# Altium project 农业-阀控器.PrjPcb
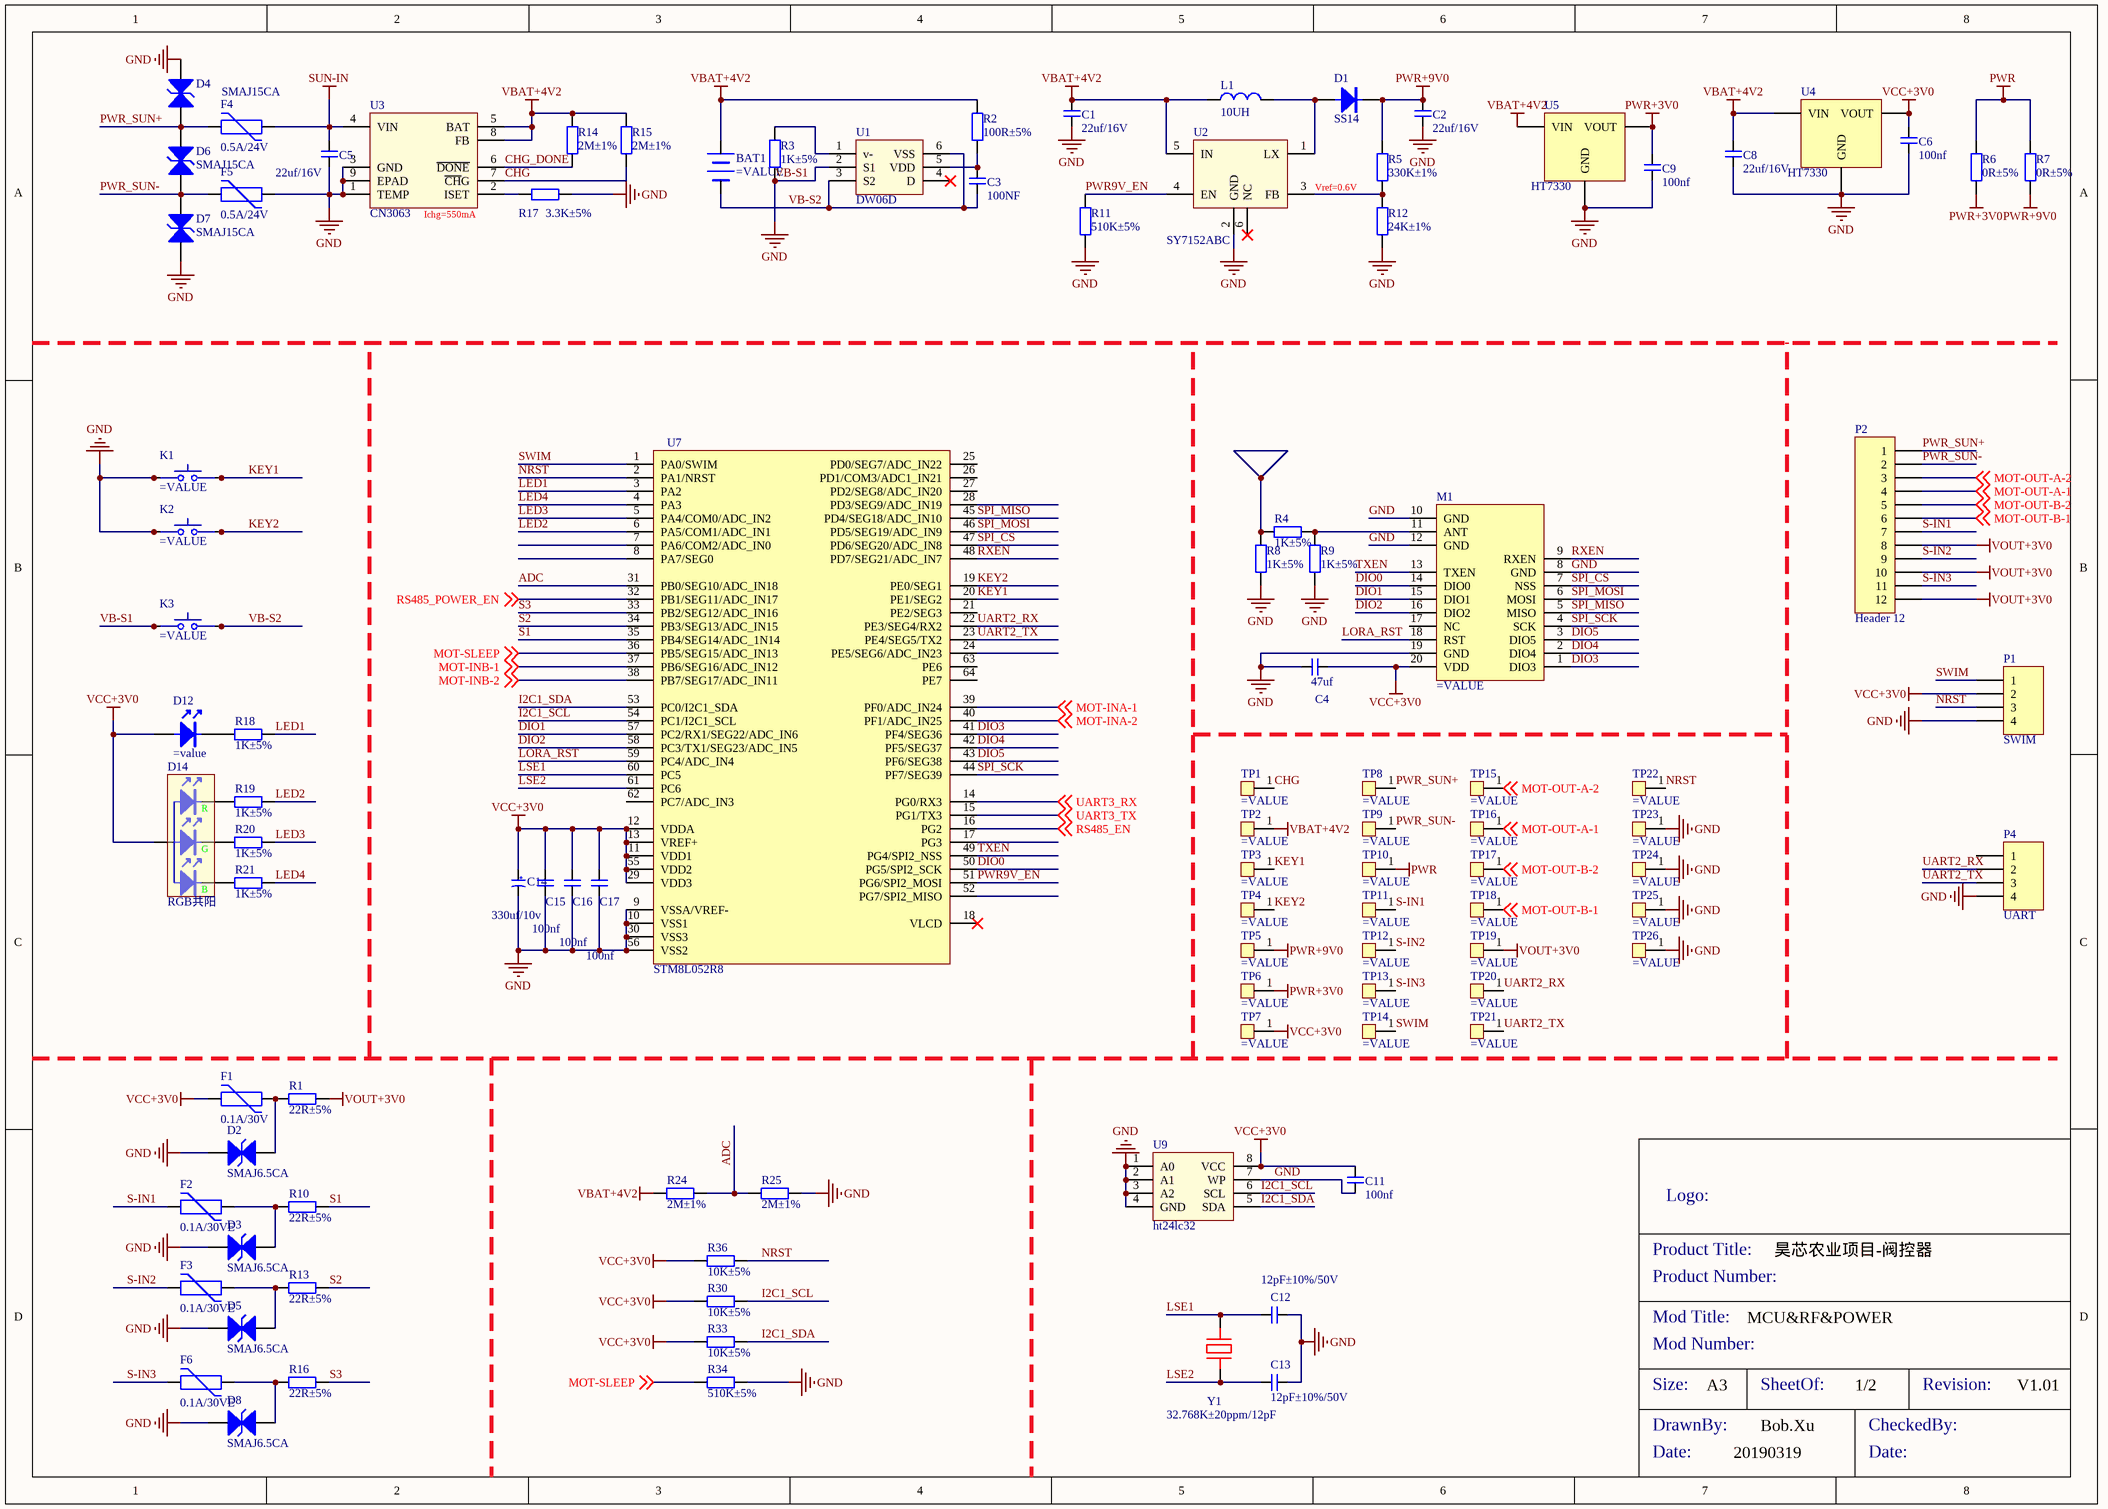
[diagram p0: RHX-NYFK-SCH21V1.01.SchDoc]
2 sheets, 131 parts. Net scope: global (net labels, ports and power ports of the same name join across sheets).
Board file: RHX-NYFK-PCB11V1.01.PcbDoc
Sheets:
  RHX-NYFK-SCH21V1.01.SchDoc
  RHX-NYFK-SCH22V1.01.SchDoc

## Sheet RHX-NYFK-SCH21V1.01.SchDoc
size A3; Date: 20190319; CompanyName: 瑞臻信息（深圳）有限公司; DrawnBy: Bob.Xu; Address1: 深圳市南山区深南路万利达大厦2201室; Address2: 昆山市花桥镇花桥国际商务城绿地大道231弄9号楼杰座大厦2111室; Address3: 成都市高新区天府二街138号蜀都中心3号楼3110室; Address4: 浙江省宁波市余姚市冶山路475号1401室; Revision: V1.01; SheetOf: 1/2; ProductTitle: 昊芯农业项目-阀控器; ModuleTitle: MCU&RF&POWER; : CheckedBy; PageSetup: Record=PageOptions|CenterHorizontal=True|CenterVertical=True|PrintScale=0.73|XCorrection=1.00|YCorrection=1.00|PrintKind=0|BorderSize=5000000|LeftOffset=0|BottomOffset=0|Orientation=2|PaperLength=1000|PaperWidth=1000|Scale=100|PaperSource=7|PrintQuality=-3|MediaType=1|DitherType=10|PrintScaleMode=1|PaperKind=A4|PaperIndex=9

### Parts
BAT1  (no value)  [HDR1X2]
C1  22uf/16V  [c1206]
C2  22uf/16V  [c1206]
C3  100NF  [C0402]
C4  47uf  [C1206]
C5  22uf/16V  [c1206]
C6  100nf  [c0402]
C8  22uf/16V  [c1206]
C9  100nf  [c0402]
C11  100nf  [C0402]
C12  12pF±10%/50V  [C0402]
C13  12pF±10%/50V  [C0402]
C14  330uf/10v  [CAP_2P_2R5_D6R3H11_W]
C15  100nf  [C0402]
C16  100nf  [C0402]
C17  100nf  [C0402]
D1  SS14  [SMA_2P_2R8X4R6]
D2  SMAJ6.5CA  [SMA_2P_2R8X4R6]
D3  SMAJ6.5CA  [SMA_2P_2R8X4R6]
D4  SMAJ15CA  [SMA_2P_2R8X4R6]
D5  SMAJ6.5CA  [SMA_2P_2R8X4R6]
D6  SMAJ15CA  [SMA_2P_2R8X4R6]
D7  SMAJ15CA  [SMA_2P_2R8X4R6]
D8  SMAJ6.5CA  [SMA_2P_2R8X4R6]
D12  (no value)  [LED_2P_2R54_D5X8R7]
D14  RGB共阳  [DIP_LED_4P_RGB_1R3_D5]
F1  0.1A/30V  [FUSE1210]
F2  0.1A/30VE  [FUSE1210]
F3  0.1A/30VE  [FUSE1210]
F4  0.5A/24V  [FUSE1210]
F5  0.5A/24V  [FUSE1210]
F6  0.1A/30VE  [FUSE1210]
K1  (no value)  [DIP_SW_4P_6R0X6R0_P]
K2  (no value)  [DIP_SW_4P_6R0X6R0_P]
K3  (no value)  [DIP_SW_4P_6R0X6R0_P]
L1  10UH  [SMD_INC_2P_4R0X4R0]
M1  (no value)  [LORA_PIN_1]
P1  SWIM  [HDR1X4]
P2  Header 12  [KF301_12P_5R08]
P4  UART  [HDR1X4]
R1  22R±5%  [R0402]
R2  100R±5%  [R0402]
R3  1K±5%  [R0402]
R4  1K±5%  [R0402]
R5  330K±1%  [R0402]
R6  0R±5%  [R0603]
R7  0R±5%  [R0603]
R8  1K±5%  [R0402]
R9  1K±5%  [R0402]
R10  22R±5%  [R0402]
R11  510K±5%  [R0402]
R12  24K±1%  [R0402]
R13  22R±5%  [R0402]
R14  2M±1%  [R0402]
R15  2M±1%  [R0402]
R16  22R±5%  [R0402]
R17  3.3K±5%  [R0402]
R18  1K±5%  [R0402]
R19  1K±5%  [R0402]
R20  1K±5%  [R0402]
R21  1K±5%  [R0402]
R24  2M±1%  [R0402]
R25  2M±1%  [R0402]
R30  10K±5%  [R0402]
R33  10K±5%  [R0402]
R34  510K±5%  [R0402]
R36  10K±5%  [R0402]
TP1  (no value)  [TP_D1R25]
TP2  (no value)  [TP_D1R25]
TP3  (no value)  [TP_D1R25]
TP4  (no value)  [TP_D1R25]
TP5  (no value)  [TP_D1R25]
TP6  (no value)  [TP_D1R25]
TP7  (no value)  [TP_D1R25]
TP8  (no value)  [TP_D1R25]
TP9  (no value)  [TP_D1R25]
TP10  (no value)  [TP_D1R25]
TP11  (no value)  [TP_D1R25]
TP12  (no value)  [TP_D1R25]
TP13  (no value)  [TP_D1R25]
TP14  (no value)  [TP_D1R25]
TP15  (no value)  [TP_D1R25]
TP16  (no value)  [TP_D1R25]
TP17  (no value)  [TP_D1R25]
TP18  (no value)  [TP_D1R25]
TP19  (no value)  [TP_D1R25]
TP20  (no value)  [TP_D1R25]
TP21  (no value)  [TP_D1R25]
TP22  (no value)  [TP_D1R25]
TP23  (no value)  [TP_D1R25]
TP24  (no value)  [TP_D1R25]
TP25  (no value)  [TP_D1R25]
TP26  (no value)  [TP_D1R25]
U1  DW06D  [SOT23_6P_0R95_1R6X2R9]
U2  SY7152ABC  [SOT23_6P_0R95_1R6X2R9]
U3  CN3063  [SOP_8P_1R27_3R9X4R9_P]
U4  HT7330  [SOT89_3P_1R5_2R5X4R5]
U5  HT7330  [SOT89_3P_1R5_2R5X4R5]
U7  STM8L052R8  [LQFP_64P_0R5_10R0X10R0]
U9  ht24lc32  [SOP_8P_1R27_3R9X4R9]
Y1  32.768K±20ppm/12pF  [SMD_Crystal_2P_1R5X3R2]

### Nets
GND: C1.1 C2.1 C4.1 C5.1 C6.1 C8.1 C9.1 C11.1 C12.1 C13.1 C14.2 C15.1 C16.1 C17.1 D2.1(A) D3.1(A) D4.2(K) D5.1(A) D7.1(A) D8.1(A) F5.2 K1.1 K1.3 K2.1 K2.3 K3.1 K3.3 M1.8(GND) M1.10(GND) M1.12(GND) M1.19(GND) P1.4 P4.4 R3.2 R8.2 R9.2 R11.2 R12.2 R17.2 R25.2 R34.1 TP23.1 TP24.1 TP25.1 TP26.1 U1.2(S1) U2.2(GND) U3.1(TEMP) U3.3(GND) U3.9(EPAD) U4.1(GND) U5.1(GND) U7.9(VSSA/VREF-) U7.10(VSS1) U7.30(VSS3) U7.56(VSS2) U9.1(A0) U9.2(A1) U9.3(A2) U9.4(GND) U9.7(WP)  [also labelled VB-S1]
PWR: R6.1 R7.1 TP10.1
PWR+3V0: C9.2 R6.2 TP6.1 U5.3(VOUT)
PWR+9V0: C2.2 D1.2(K) R5.1 R7.2 TP5.1
SUN-IN: C5.2 F4.2 U3.4(VIN)
VBAT+4V2: BAT1.1 C1.2 C8.2 L1.1 R2.1 R14.2 R15.2 R24.1 TP2.1 U2.5(IN) U3.5(BAT) U3.8(FB) U4.2(VIN) U5.2(VIN)
VCC+3V0: C4.2 C6.2 C11.2 C14.1 C15.2 C16.2 C17.2 D12.1(A) D14.2 F1.1 M1.20(VDD) P1.2 R30.2 R33.2 R36.2 TP7.1 U4.3(VOUT) U7.11(VDD1) U7.12(VDDA) U7.13(VREF+) U7.29(VDD3) U7.55(VDD2) U9.8(VCC)
VOUT+3V0: P2.8 P2.10 P2.12 R1.1 TP19.1
ADC: R24.2 R25.1 U7.31(PB0/SEG10/ADC_IN18)
CHG: R15.1 TP1.1 U3.7(~{CH}G)
CHG_DONE: R14.1 U3.6(~{DONE})
DIO0: M1.14(DIO0) U7.50(PG5/SPI2_SCK)
DIO1: M1.15(DIO1) U7.57(PC2/RX1/SEG22/ADC_IN6)
DIO2: M1.16(DIO2) U7.58(PC3/TX1/SEG23/ADC_IN5)
DIO3: M1.1(DIO3) U7.41(PF4/SEG36)
DIO4: M1.2(DIO4) U7.42(PF5/SEG37)
DIO5: M1.3(DIO5) U7.43(PF6/SEG38)
I2C1_SCL: R30.1 U7.54(PC1/I2C1_SCL) U9.6(SCL)
I2C1_SDA: R33.1 U7.53(PC0/I2C1_SDA) U9.5(SDA)
KEY1: K1.2 K1.4 TP3.1 U7.20(PE1/SEG2)
KEY2: K2.2 K2.4 TP4.1 U7.19(PE0/SEG1)
LED1: R18.1 U7.3(PA2)
LED2: R19.1 U7.6(PA5/COM1/ADC_IN1)
LED3: R20.1 U7.5(PA4/COM0/ADC_IN2)
LED4: R21.1 U7.4(PA3)
LORA_RST: M1.18(RST) U7.59(PC4/ADC_IN4)
LSE1: C12.2 U7.60(PC5) Y1.2
LSE2: C13.2 U7.61(PC6) Y1.1
MOT-INA-1: U7.39(PF0/ADC_IN24) ; off-sheet MOT-INA-1
MOT-INA-2: U7.40(PF1/ADC_IN25) ; off-sheet MOT-INA-2
MOT-INB-1: U7.37(PB6/SEG16/ADC_IN12) ; off-sheet MOT-INB-1
MOT-INB-2: U7.38(PB7/SEG17/ADC_IN11) ; off-sheet MOT-INB-2
MOT-OUT-A-1: P2.4 TP16.1 ; off-sheet MOT-OUT-A-1
MOT-OUT-A-2: P2.3 TP15.1 ; off-sheet MOT-OUT-A-2
MOT-OUT-B-1: P2.6 TP18.1 ; off-sheet MOT-OUT-B-1
MOT-OUT-B-2: P2.5 TP17.1 ; off-sheet MOT-OUT-B-2
MOT-SLEEP: R34.2 U7.36(PB5/SEG15/ADC_IN13) ; off-sheet MOT-SLEEP
NRST: P1.3 R36.1 TP22.1 U7.2(PA1/NRST)
PWR9V_EN: R11.1 U2.4(EN) U7.51(PG6/SPI2_MOSI)
PWR_SUN+: D4.1(A) D6.2(K) F4.1 P2.1 TP8.1
PWR_SUN-: D6.1(A) D7.2(K) F5.1 P2.2 TP9.1
RS485_EN: U7.16(PG2) ; off-sheet RS485_EN
RS485_POWER_EN: U7.32(PB1/SEG11/ADC_IN17) ; off-sheet RS485_POWER_EN
RXEN: M1.9(RXEN) U7.48(PD7/SEG21/ADC_IN7)
S1: R10.1 U7.35(PB4/SEG14/ADC_1N14)
S2: R13.1 U7.34(PB3/SEG13/ADC_IN15)
S3: R16.1 U7.33(PB2/SEG12/ADC_IN16)
S-IN1: F2.1 P2.7 TP11.1
S-IN2: F3.1 P2.9 TP12.1
S-IN3: F6.1 P2.11 TP13.1
SPI_CS: M1.7(NSS) U7.47(PD6/SEG20/ADC_IN8)
SPI_MISO: M1.5(MISO) U7.45(PD4/SEG18/ADC_IN10)
SPI_MOSI: M1.6(MOSI) U7.46(PD5/SEG19/ADC_IN9)
SPI_SCK: M1.4(SCK) U7.44(PF7/SEG39)
SWIM: P1.1 TP14.1 U7.1(PA0/SWIM)
TXEN: M1.13(TXEN) U7.49(PG4/SPI2_NSS)
UART2_RX: P4.2 TP20.1 U7.22(PE3/SEG4/RX2)
UART2_TX: P4.3 TP21.1 U7.23(PE4/SEG5/TX2)
UART3_RX: U7.14(PG0/RX3) ; off-sheet UART3_RX
UART3_TX: U7.15(PG1/TX3) ; off-sheet UART3_TX
VB-S2: BAT1.2 C3.1 K3.2 K3.4 U1.3(S2) U1.6(VSS)
NetC3_2: C3.2 R2.2 U1.5(VDD)
NetD1_1: D1.1(A) L1.2 U2.1(LX)
NetD2_2: D2.2(K) F1.2 R1.2
NetD3_2: D3.2(K) F2.2 R10.2
NetD5_2: D5.2(K) F3.2 R13.2
NetD8_2: D8.2(K) F6.2 R16.2
NetD12_2: D12.2(K) R18.2
NetD14_1: D14.1 R19.2
NetD14_3: D14.3 R20.2
NetD14_4: D14.4 R21.2
NetM1_11: M1.11(ANT) R4.1 R9.1
NetR3_1: R3.1 U1.1(v-)
NetR4_2: R4.2 R8.1
NetR5_2: R5.2 R12.1 U2.3(FB)
NetR17_1: R17.1 U3.2(ISET)

Not connected (* = marked no-connect by the designer): M1 17(NC); P4 1; U1 4(D)*; U2 6(NC)*; U7 7(PA6/COM2/ADC_IN0) 8(PA7/SEG0) 17(PG3) 18(VLCD)* 21(PE2/SEG3) 24(PE5/SEG6/ADC_IN23) 25(PD0/SEG7/ADC_IN22) 26(PD1/COM3/ADC1_IN21) 27(PD2/SEG8/ADC_IN20) 28(PD3/SEG9/ADC_IN19) 52(PG7/SPI2_MISO) 62(PC7/ADC_IN3) 63(PE6) 64(PE7)

### Notes on the sheet
- (near U3) Ichg=550mA
- Vref=0.6V
- Product Title:
- Logo:
- Product Number:
- Mod Title:
- Size:
- Mod Number:
- A3
- SheetOf:
- Revision:
- DrawnBy:
- Date:
- CheckedBy:
- (in symbol LED-RGB-共阳) R; G; B

### Library data of the parts
BAT1 = BAT
C1-C6 C8 C9 C11-C13 C15-C17 = 无极性电容
C14 = 极性电容
D1 = 普通二极管
D2-D8 = 双向TVS管
D12 = 单LED
D14 = LED-RGB-共阳
F1-F6 = PPTC
K1-K3 = SKRWAEE030: 4脚贴片按键
L1 = 普通电感
M1 = LORA_PIN_1
P1 P4 = Header 4: Header, 4-Pin; LatestRevisionDate: 17-Jul-2002; LatestRevisionNote: Re-released for DXP Platform.; Publisher: Altium Limited
P2 = Header 12: Header, 12-Pin; LatestRevisionDate: 17-Jul-2002; LatestRevisionNote: Re-released for DXP Platform.; Publisher: Altium Limited
R1-R3 R10 R13 R16-R21 = 1.2.03.01.0573: 电阻-4.7R±5%-1/16W-0402; Supplier Manufacturer: 厂家; Old P/N: 01747; Value: 4.7R±5%; D/S: S; Edit Note: V1.0-创建-20161225-徐永伟; Grade: A; Part Number: 1.2.03.01.0573; Part Type: 贴片电阻; ComponentLink1URL: z:\altiumdesigner\规格书\02原材料\03电阻\01普通电阻\; Supplier: 供应商; Unit Price: ￥0.001; Footprint: 0402; ComponentLink1Description: 规格书; Component Type: standy; ComponentLink2Description: ROHS报告; ComponentLink2URL: z:\altiumdesigner\规格书\02原材料\03电阻\01普通电阻\; Pin Count: 2; Published: V1.0; Publisher: 徐永伟; ComponentLink3Description: 可靠性测试报告; ComponentLink3URL: z:\altiumdesigner\规格书\02原材料\03电阻\01普通电阻\; ComponentLink4URL: z:\altiumdesigner\规格书\02原材料\03电阻\01普通电阻\; ComponentLink4Description: 性能检测报告
R4-R9 R11 R12 R14 R15 R24 R25 R34 = 1.2.03.01.0012: 电阻-10K±5%-1/16W-0402; Supplier Manufacturer: 厂家; Old P/N: 00527; Value: 10K±5%; D/S: S; Edit Note: V1.0-创建-20161225-徐永伟; Grade: A; Part Number: 1.2.03.01.0012; Part Type: 贴片电阻; ComponentLink1URL: z:\altiumdesigner\规格书\02原材料\03电阻\01普通电阻\; Supplier: 供应商; Unit Price: ￥0.001; Footprint: 0402; ComponentLink1Description: 规格书; Component Type: standy; ComponentLink2Description: ROHS报告; ComponentLink2URL: z:\altiumdesigner\规格书\02原材料\03电阻\01普通电阻\; Pin Count: 2; Published: V1.0; Publisher: 徐永伟; ComponentLink3Description: 可靠性测试报告; ComponentLink3URL: z:\altiumdesigner\规格书\02原材料\03电阻\01普通电阻\; ComponentLink4URL: z:\altiumdesigner\规格书\02原材料\03电阻\01普通电阻\; ComponentLink4Description: 性能检测报告
R30 R33 R36 = 1.2.03.01.0012: 电阻-10K±5%-1/16W-0402; Supplier Manufacturer: 厂家; Old P/N: 00527; D/S: S; Edit Note: V1.0-创建-20161225-徐永伟; Grade: A; Part Number: 1.2.03.01.0012; Part Type: 贴片电阻; Value: 10K±5%; ComponentLink1URL: z:\altiumdesigner\规格书\02原材料\03电阻\01普通电阻\; Supplier: 供应商; Unit Price: ￥0.001; Footprint: 0402; ComponentLink1Description: 规格书; Component Type: standy; ComponentLink2Description: ROHS报告; ComponentLink2URL: z:\altiumdesigner\规格书\02原材料\03电阻\01普通电阻\; Pin Count: 2; Published: V1.0; Publisher: 徐永伟; ComponentLink3Description: 可靠性测试报告; ComponentLink3URL: z:\altiumdesigner\规格书\02原材料\03电阻\01普通电阻\; ComponentLink4URL: z:\altiumdesigner\规格书\02原材料\03电阻\01普通电阻\; ComponentLink4Description: 性能检测报告
TP1-TP26 = Test_Point: 测试点
U2 = SY7152
U4 U5 = HT73XX
U7 = 1.2.18.01.0001: MCU_STM8L052R8_16MHz_Flash/64Kb_RAM/4Kb_8位_E2PROM/256B_LCD8X24_LQFP64; 厂家: ST; 器件高度: 1.6mm; 厂家型号: STM8L052R8T6; 单价: ￥0.001; D/S: S; Edit Note: V1.0-创建-20170105-徐永伟; 物料状态: 量产; Part Number: 1.2.18.01.0001; Part Type: MCU; Value: STM8L052R8; ComponentLink1URL: Z:\规格书\02原材料\18集成电路\01通用处理器\STM8L052R8.pdf; Footprint: LQFP64; ComponentLink1Description: 规格书; Component Type: standy; ComponentLink2Description: 用户手册; ComponentLink2URL: Z:\规格书\02原材料\18集成电路\01通用处理器\STM8L参考手册.pdf; Pin Count: 64; Published: V1.0; Publisher: 徐永伟
U9 = 24CXX
Y1 = 两脚晶体谐振器

## Sheet RHX-NYFK-SCH22V1.01.SchDoc
size A3; Date: 20190319; CompanyName: 瑞臻信息（深圳）有限公司; DrawnBy: Bob.Xu; Address1: 深圳市南山区深南路万利达大厦2201室; Address2: 昆山市花桥镇花桥国际商务城绿地大道231弄9号楼杰座大厦2111室; Address3: 成都市高新区天府二街138号蜀都中心3号楼3110室; Address4: 浙江省宁波市余姚市冶山路475号1401室; Revision: V1.01; SheetOf: 2/2; ProductTitle: 昊芯农业项目-阀控器; ModuleTitle: RS485&MOTOR; : CheckedBy; PageSetup: Record=PageOptions|CenterHorizontal=True|CenterVertical=True|PrintScale=0.73|XCorrection=1.00|YCorrection=1.00|PrintKind=0|BorderSize=5000000|LeftOffset=0|BottomOffset=0|Orientation=2|PaperLength=1000|PaperWidth=1000|Scale=100|PaperSource=7|PrintQuality=-3|MediaType=1|DitherType=10|PrintScaleMode=1|PaperKind=A4|PaperIndex=9
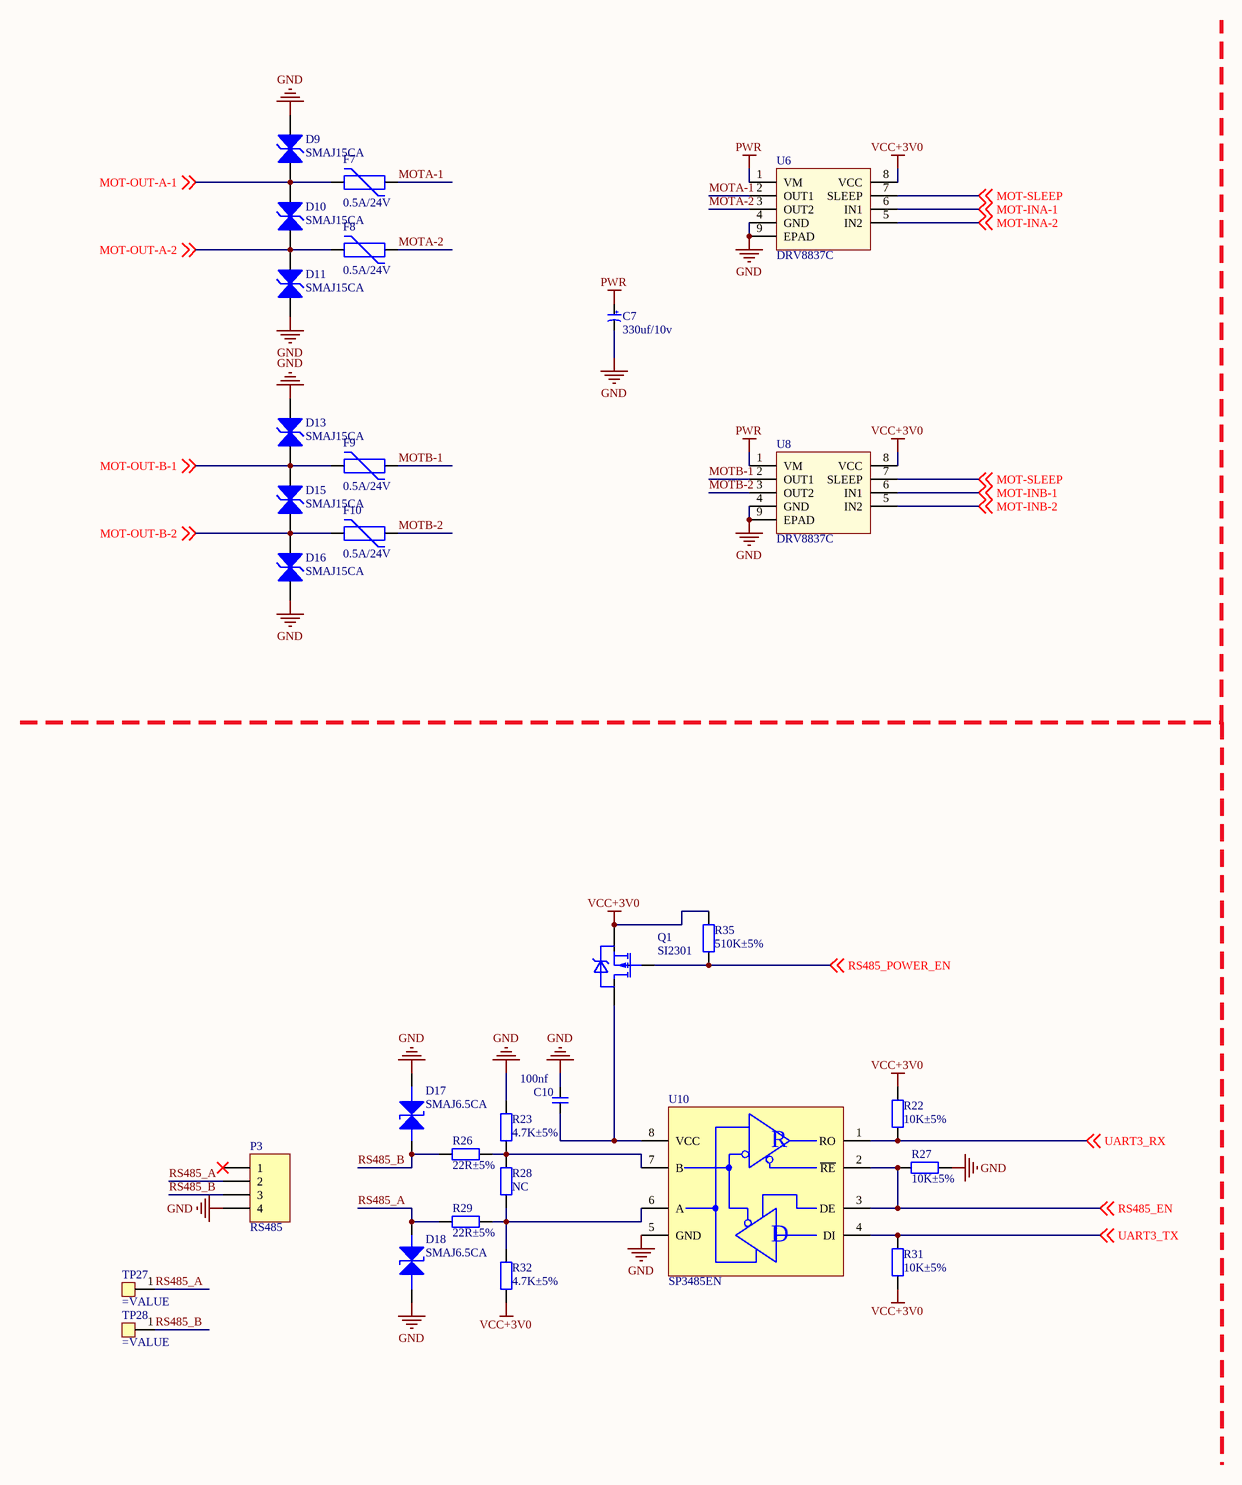
[diagram p1: RHX-NYFK-SCH22V1.01.SchDoc]

### Parts
C7  330uf/10v  [CAP_2P_2R5_D6R3H11_W]
C10  100nf  [c0402]
D9  SMAJ15CA  [SMA_2P_2R8X4R6]
D10  SMAJ15CA  [SMA_2P_2R8X4R6]
D11  SMAJ15CA  [SMA_2P_2R8X4R6]
D13  SMAJ15CA  [SMA_2P_2R8X4R6]
D15  SMAJ15CA  [SMA_2P_2R8X4R6]
D16  SMAJ15CA  [SMA_2P_2R8X4R6]
D17  SMAJ6.5CA  [SMA_2P_2R8X4R6]
D18  SMAJ6.5CA  [SMA_2P_2R8X4R6]
F7  0.5A/24V  [FUSE1210]
F8  0.5A/24V  [FUSE1210]
F9  0.5A/24V  [FUSE1210]
F10  0.5A/24V  [FUSE1210]
P3  RS485  [HDR1X4]
Q1  SI2301  [SOT23_3P_0R95_1R3X2R9]
R22  10K±5%  [R0402]
R23  4.7K±5%  [R0402]
R26  22R±5%  [R0402]
R27  10K±5%  [R0402]
R28  NC  [R0402]
R29  22R±5%  [R0402]
R31  10K±5%  [R0402]
R32  4.7K±5%  [R0402]
R35  510K±5%  [R0402]
TP27  (no value)  [TP_D1R25]
TP28  (no value)  [TP_D1R25]
U6  DRV8837C  [TDFN_8P_0R5_2R0X2R0_P]
U8  DRV8837C  [TDFN_8P_0R5_2R0X2R0_P]
U10  SP3485EN  [SOP_8P_1R27_3R9X4R9]

### Nets
GND: C7.2 C10.2 D9.2(K) D11.1(A) D13.2(K) D16.1(A) D17.2(K) D18.2(K) P3.4 R23.2 R27.2 U6.4(GND) U6.9(EPAD) U8.4(GND) U8.9(EPAD) U10.5(GND)
PWR: C7.1 U6.1(VM) U8.1(VM)
VCC+3V0: Q1.2(S) R22.2 R31.1 R32.1 R35.1 U6.8(VCC) U8.8(VCC)
MOT-INA-1: U6.6(IN1) ; off-sheet MOT-INA-1
MOT-INA-2: U6.5(IN2) ; off-sheet MOT-INA-2
MOT-INB-1: U8.6(IN1) ; off-sheet MOT-INB-1
MOT-INB-2: U8.5(IN2) ; off-sheet MOT-INB-2
MOT-OUT-A-1: D9.1(A) D10.2(K) F7.1 ; off-sheet MOT-OUT-A-1
MOT-OUT-A-2: D10.1(A) D11.2(K) F8.1 ; off-sheet MOT-OUT-A-2
MOT-OUT-B-1: D13.1(A) D15.2(K) F9.1 ; off-sheet MOT-OUT-B-1
MOT-OUT-B-2: D15.1(A) D16.2(K) F10.1 ; off-sheet MOT-OUT-B-2
MOT-SLEEP: U6.7(SLEEP) U8.7(SLEEP) ; off-sheet MOT-SLEEP
MOTA-1: F7.2 U6.2(OUT1)
MOTA-2: F8.2 U6.3(OUT2)
MOTB-1: F9.2 U8.2(OUT1)
MOTB-2: F10.2 U8.3(OUT2)
RS485_A: D18.1(A) P3.2 R29.2 TP27.1
RS485_B: D17.1(A) P3.3 R26.2 TP28.1
RS485_EN: R27.1 U10.2(~{RE}) U10.3(DE) ; off-sheet RS485_EN
RS485_POWER_EN: Q1.1(G) R35.2 ; off-sheet RS485_POWER_EN
UART3_RX: R22.1 U10.1(RO) ; off-sheet UART3_RX
UART3_TX: R31.2 U10.4(DI) ; off-sheet UART3_TX
NetC10_1: C10.1 Q1.3(D) U10.8(VCC)
NetR23_1: R23.1 R26.1 R28.2 U10.7(B)
NetR28_1: R28.1 R29.1 R32.2 U10.6(A)

Not connected (* = marked no-connect by the designer): P3 1*

### Notes on the sheet
- Product Title:
- Logo:
- Product Number:
- Mod Title:
- Size:
- Mod Number:
- A3
- SheetOf:
- Revision:
- DrawnBy:
- Date:
- CheckedBy:
- (in symbol 1.2.18.09.0173) R; D

### Library data of the parts
C7 = 极性电容
C10 = 无极性电容
D9-D11 D13 D15 D16 = 双向TVS管
D17 D18 = 1.2.08.07.0014: TVS管-SMBJ6.5CA-53.6A-单路-6.5Vrwm-8.3Vbr-600W-SMB
F7-F10 = PPTC
P3 = Header 4: Header, 4-Pin; LatestRevisionDate: 17-Jul-2002; LatestRevisionNote: Re-released for DXP Platform.; Publisher: Altium Limited
Q1 = P-MOS
R22 R27 R31 = 1.2.03.01.0012: as R30 on sheet RHX-NYFK-SCH21V1.01; Part Number: 1.2.03.01.0012; Part Type: 贴片电阻; Value: 10K±5%; ComponentLink1URL: z:\altiumdesigner\规格书\02原材料\03电阻\01普通电阻\; Supplier: 供应商; Unit Price: ￥0.001; Footprint: 0402; ComponentLink1Description: 规格书; Component Type: standy; ComponentLink2Description: ROHS报告; ComponentLink2URL: z:\altiumdesigner\规格书\02原材料\03电阻\01普通电阻\; Pin Count: 2; Published: V1.0; Publisher: 徐永伟; ComponentLink3Description: 可靠性测试报告; ComponentLink3URL: z:\altiumdesigner\规格书\02原材料\03电阻\01普通电阻\; ComponentLink4URL: z:\altiumdesigner\规格书\02原材料\03电阻\01普通电阻\; ComponentLink4Description: 性能检测报告
R23 R32 = 1.2.03.01.0366: 电阻-4.7K±5%-1/16W-0402; Supplier Manufacturer: 厂家; Old P/N: 00810; D/S: S; Edit Note: V1.0-创建-20161225-徐永伟; Grade: A; Part Number: 1.2.03.01.0366; Part Type: 贴片电阻; Value: 4.7K±5%; ComponentLink1URL: z:\altiumdesigner\规格书\02原材料\03电阻\01普通电阻\; Supplier: 供应商; Unit Price: ￥0.001; Footprint: 0402; ComponentLink1Description: 规格书; Component Type: standy; ComponentLink2Description: ROHS报告; ComponentLink2URL: z:\altiumdesigner\规格书\02原材料\03电阻\01普通电阻\; Pin Count: 2; Published: V1.0; Publisher: 徐永伟; ComponentLink3Description: 可靠性测试报告; ComponentLink3URL: z:\altiumdesigner\规格书\02原材料\03电阻\01普通电阻\; ComponentLink4URL: z:\altiumdesigner\规格书\02原材料\03电阻\01普通电阻\; ComponentLink4Description: 性能检测报告
R26 R29 = 1.2.03.01.0573: as R1 on sheet RHX-NYFK-SCH21V1.01; Part Number: 1.2.03.01.0573; Part Type: 贴片电阻; ComponentLink1URL: z:\altiumdesigner\规格书\02原材料\03电阻\01普通电阻\; Supplier: 供应商; Unit Price: ￥0.001; Footprint: 0402; ComponentLink1Description: 规格书; Component Type: standy; ComponentLink2Description: ROHS报告; ComponentLink2URL: z:\altiumdesigner\规格书\02原材料\03电阻\01普通电阻\; Pin Count: 2; Published: V1.0; Publisher: 徐永伟; ComponentLink3Description: 可靠性测试报告; ComponentLink3URL: z:\altiumdesigner\规格书\02原材料\03电阻\01普通电阻\; ComponentLink4URL: z:\altiumdesigner\规格书\02原材料\03电阻\01普通电阻\; ComponentLink4Description: 性能检测报告
R28 R35 = 1.2.03.01.0012: as R4 on sheet RHX-NYFK-SCH21V1.01; Part Number: 1.2.03.01.0012; Part Type: 贴片电阻; ComponentLink1URL: z:\altiumdesigner\规格书\02原材料\03电阻\01普通电阻\; Supplier: 供应商; Unit Price: ￥0.001; Footprint: 0402; ComponentLink1Description: 规格书; Component Type: standy; ComponentLink2Description: ROHS报告; ComponentLink2URL: z:\altiumdesigner\规格书\02原材料\03电阻\01普通电阻\; Pin Count: 2; Published: V1.0; Publisher: 徐永伟; ComponentLink3Description: 可靠性测试报告; ComponentLink3URL: z:\altiumdesigner\规格书\02原材料\03电阻\01普通电阻\; ComponentLink4URL: z:\altiumdesigner\规格书\02原材料\03电阻\01普通电阻\; ComponentLink4Description: 性能检测报告
TP27 TP28 = Test_Point: 测试点
U10 = 1.2.18.09.0173: RS485收发器-SP3485EN-支持485收发-SOP8; Supplier Manufacturer: Sipex; Old P/N: 00289; D/S: S; Edit Note: V1.0-创建-20170122-徐永伟; Grade: A; Part Number: 1.2.18.09.0173; ComponentLink1URL: Z:\AltiumDesigner\规格书\02原材料\18集成电路\09接口芯片\SP3485EN.pdf; ComponentLink1Description: 规格书; ComponentLink2Description: ROHS报告; Part Type: 接口IC; Value: SP3485EN; height: 1.7mm; Model: SP3485EN; Unit Price: ￥0.001; Footprint: SOP8; Component Type: standy; Pin Count: 8; Published: V1.0; Publisher: 徐永伟

## Nets that join several sheets
GND: RHX-NYFK-SCH21V1.01 (61 pins), RHX-NYFK-SCH22V1.01 (16 pins)
PWR: RHX-NYFK-SCH21V1.01 (R6.1 R7.1 TP10.1), RHX-NYFK-SCH22V1.01 (C7.1 U6.1 U8.1)
VCC+3V0: RHX-NYFK-SCH21V1.01 (23 pins), RHX-NYFK-SCH22V1.01 (7 pins)
MOT-INA-1: RHX-NYFK-SCH21V1.01 (U7.39), RHX-NYFK-SCH22V1.01 (U6.6)
MOT-INA-2: RHX-NYFK-SCH21V1.01 (U7.40), RHX-NYFK-SCH22V1.01 (U6.5)
MOT-INB-1: RHX-NYFK-SCH21V1.01 (U7.37), RHX-NYFK-SCH22V1.01 (U8.6)
MOT-INB-2: RHX-NYFK-SCH21V1.01 (U7.38), RHX-NYFK-SCH22V1.01 (U8.5)
MOT-OUT-A-1: RHX-NYFK-SCH21V1.01 (P2.4 TP16.1), RHX-NYFK-SCH22V1.01 (D9.1 D10.2 F7.1)
MOT-OUT-A-2: RHX-NYFK-SCH21V1.01 (P2.3 TP15.1), RHX-NYFK-SCH22V1.01 (D10.1 D11.2 F8.1)
MOT-OUT-B-1: RHX-NYFK-SCH21V1.01 (P2.6 TP18.1), RHX-NYFK-SCH22V1.01 (D13.1 D15.2 F9.1)
MOT-OUT-B-2: RHX-NYFK-SCH21V1.01 (P2.5 TP17.1), RHX-NYFK-SCH22V1.01 (D15.1 D16.2 F10.1)
MOT-SLEEP: RHX-NYFK-SCH21V1.01 (R34.2 U7.36), RHX-NYFK-SCH22V1.01 (U6.7 U8.7)
RS485_EN: RHX-NYFK-SCH21V1.01 (U7.16), RHX-NYFK-SCH22V1.01 (R27.1 U10.2 U10.3)
RS485_POWER_EN: RHX-NYFK-SCH21V1.01 (U7.32), RHX-NYFK-SCH22V1.01 (Q1.1 R35.2)
UART3_RX: RHX-NYFK-SCH21V1.01 (U7.14), RHX-NYFK-SCH22V1.01 (R22.1 U10.1)
UART3_TX: RHX-NYFK-SCH21V1.01 (U7.15), RHX-NYFK-SCH22V1.01 (R31.2 U10.4)